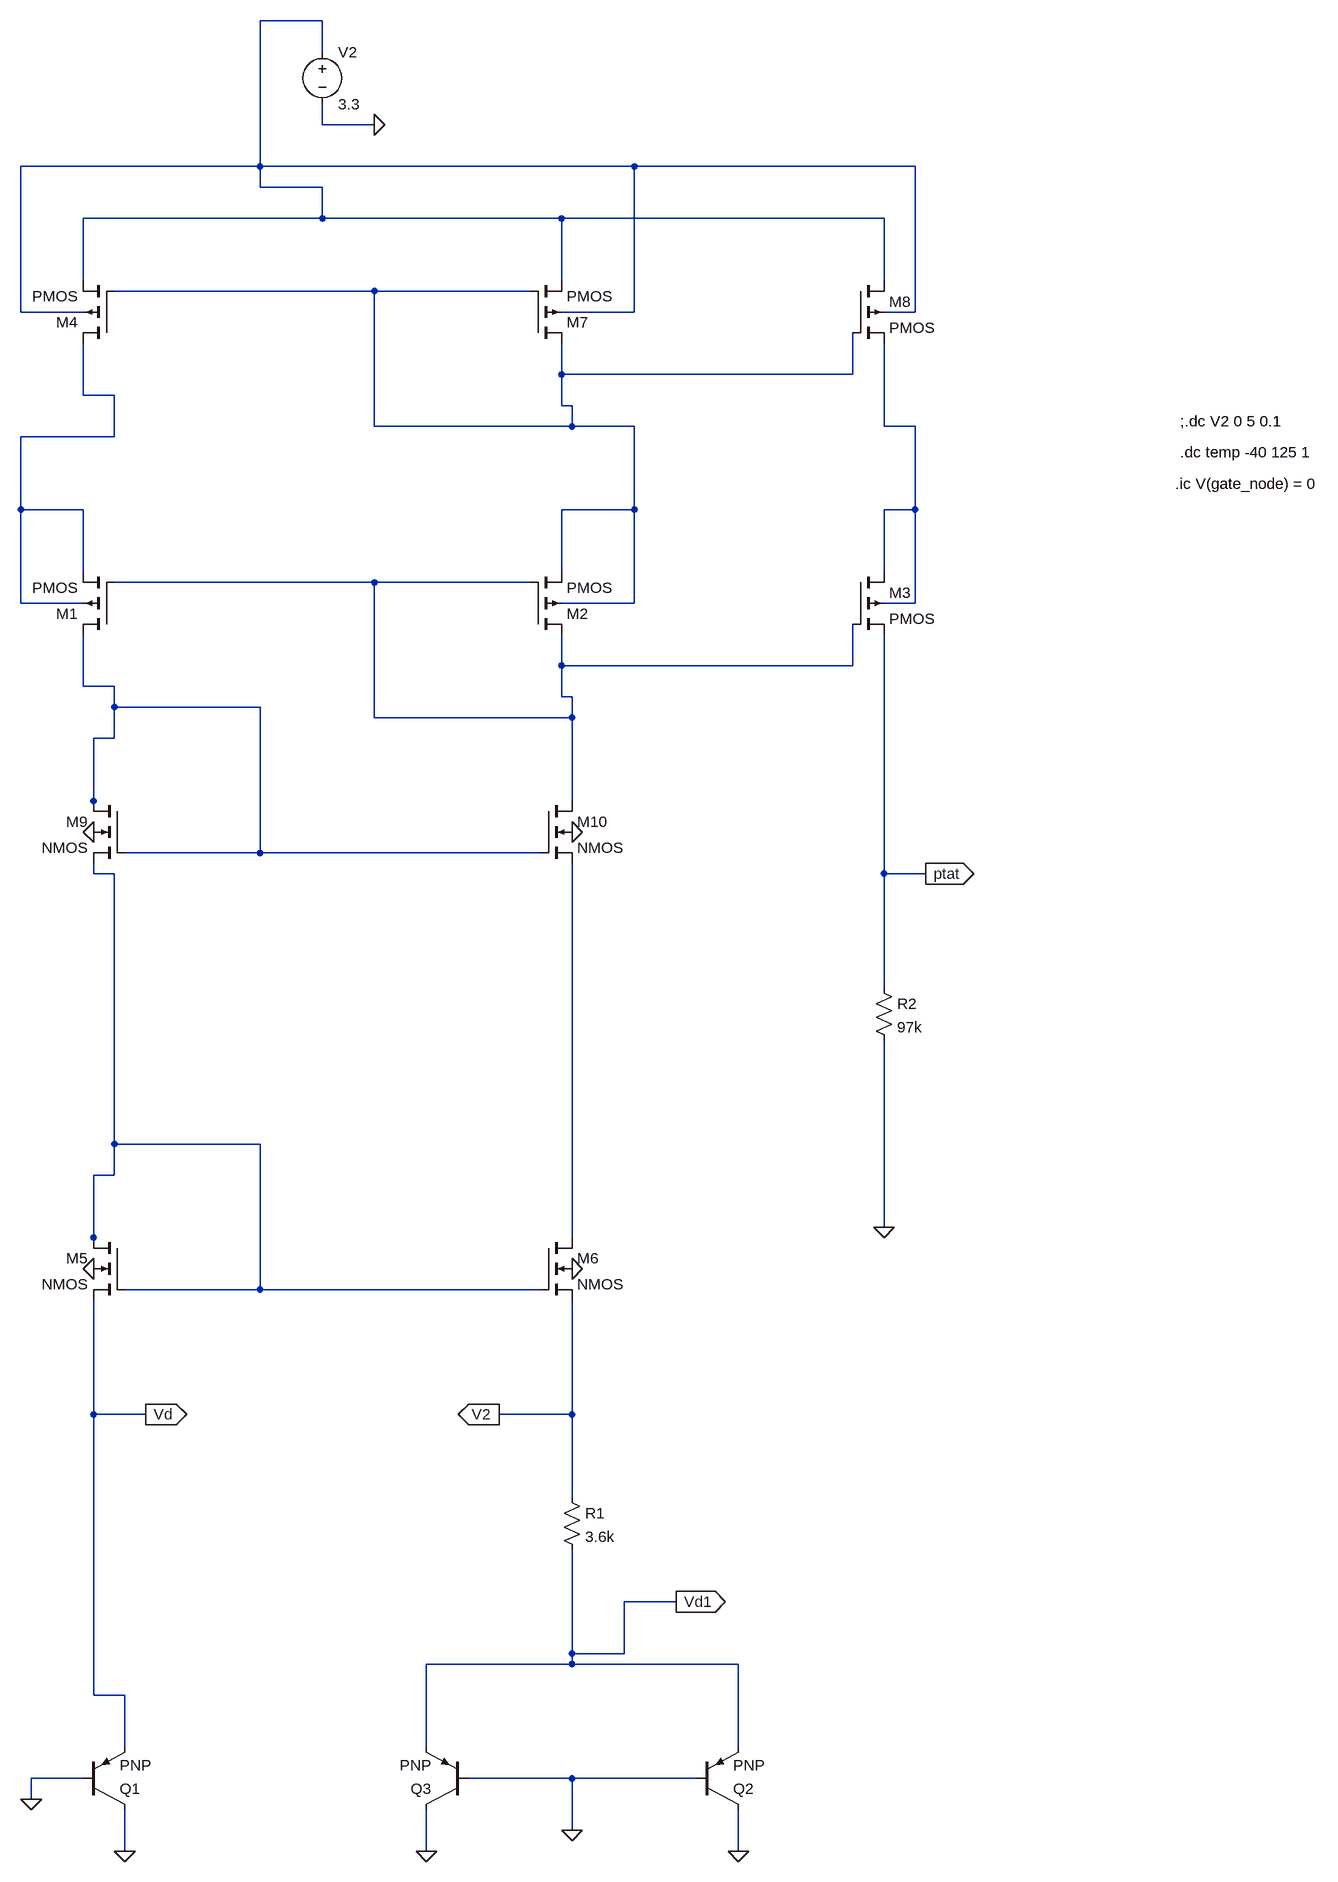
[diagram p0: schematic ptat.asc]
ptat.asc, the LTspice schematic file:
Version 4.1
SHEET 1 2292 692
WIRE 416 -2144 320 -2144
WIRE 416 -2096 416 -2144
WIRE 416 -1984 416 -2016
WIRE 496 -1984 416 -1984
WIRE 320 -1920 320 -2144
WIRE 320 -1920 -48 -1920
WIRE 896 -1920 320 -1920
WIRE 1328 -1920 896 -1920
WIRE 320 -1888 320 -1920
WIRE 416 -1888 320 -1888
WIRE 416 -1840 416 -1888
WIRE 416 -1840 48 -1840
WIRE 784 -1840 416 -1840
WIRE 1280 -1840 784 -1840
WIRE 48 -1744 48 -1840
WIRE 784 -1744 784 -1840
WIRE 1280 -1744 1280 -1840
WIRE 496 -1728 96 -1728
WIRE 736 -1728 496 -1728
WIRE -48 -1696 -48 -1920
WIRE 48 -1696 -48 -1696
WIRE 896 -1696 896 -1920
WIRE 896 -1696 784 -1696
WIRE 1328 -1696 1328 -1920
WIRE 1328 -1696 1280 -1696
WIRE 784 -1600 784 -1648
WIRE 1232 -1600 1232 -1664
WIRE 1232 -1600 784 -1600
WIRE 48 -1568 48 -1648
WIRE 96 -1568 48 -1568
WIRE 784 -1552 784 -1600
WIRE 800 -1552 784 -1552
WIRE 496 -1520 496 -1728
WIRE 800 -1520 800 -1552
WIRE 800 -1520 496 -1520
WIRE 896 -1520 800 -1520
WIRE 1280 -1520 1280 -1648
WIRE 1328 -1520 1280 -1520
WIRE 96 -1504 96 -1568
WIRE 96 -1504 -48 -1504
WIRE -48 -1392 -48 -1504
WIRE 48 -1392 -48 -1392
WIRE 896 -1392 896 -1520
WIRE 896 -1392 784 -1392
WIRE 1328 -1392 1328 -1520
WIRE 1328 -1392 1280 -1392
WIRE 48 -1296 48 -1392
WIRE 784 -1296 784 -1392
WIRE 1280 -1296 1280 -1392
WIRE 496 -1280 96 -1280
WIRE 736 -1280 496 -1280
WIRE -48 -1248 -48 -1392
WIRE 48 -1248 -48 -1248
WIRE 896 -1248 896 -1392
WIRE 896 -1248 784 -1248
WIRE 1328 -1248 1328 -1392
WIRE 1328 -1248 1280 -1248
WIRE 784 -1152 784 -1200
WIRE 1232 -1152 1232 -1216
WIRE 1232 -1152 784 -1152
WIRE 48 -1120 48 -1200
WIRE 96 -1120 48 -1120
WIRE 784 -1104 784 -1152
WIRE 800 -1104 784 -1104
WIRE 96 -1088 96 -1120
WIRE 320 -1088 96 -1088
WIRE 496 -1072 496 -1280
WIRE 800 -1072 800 -1104
WIRE 800 -1072 496 -1072
WIRE 96 -1040 96 -1088
WIRE 96 -1040 64 -1040
WIRE 64 -944 64 -1040
WIRE 800 -944 800 -1072
WIRE 64 -928 64 -944
WIRE 320 -864 320 -1088
WIRE 320 -864 112 -864
WIRE 752 -864 320 -864
WIRE 64 -832 64 -848
WIRE 96 -832 64 -832
WIRE 1280 -832 1280 -1200
WIRE 1344 -832 1280 -832
WIRE 1280 -656 1280 -832
WIRE 96 -416 96 -832
WIRE 320 -416 96 -416
WIRE 96 -368 96 -416
WIRE 96 -368 64 -368
WIRE 1280 -288 1280 -576
WIRE 64 -272 64 -368
WIRE 800 -272 800 -848
WIRE 64 -256 64 -272
WIRE 320 -192 320 -416
WIRE 320 -192 112 -192
WIRE 752 -192 320 -192
WIRE 64 0 64 -176
WIRE 144 0 64 0
WIRE 800 0 800 -176
WIRE 800 0 688 0
WIRE 800 128 800 0
WIRE 960 288 880 288
WIRE 800 368 800 208
WIRE 880 368 880 288
WIRE 880 368 800 368
WIRE 800 384 800 368
WIRE 800 384 576 384
WIRE 1056 384 800 384
WIRE 64 432 64 0
WIRE 112 432 64 432
WIRE 112 512 112 432
WIRE 576 512 576 384
WIRE 1056 512 1056 384
WIRE 48 560 -32 560
WIRE 800 560 640 560
WIRE 992 560 800 560
WIRE -32 592 -32 560
WIRE 800 640 800 560
WIRE 112 672 112 608
WIRE 576 672 576 608
WIRE 1056 672 1056 608
FLAG 112 672 0
FLAG -32 592 0
FLAG 800 640 0
FLAG 576 672 0
FLAG 1056 672 0
FLAG 960 288 Vd1
IOPIN 960 288 Out
FLAG 144 0 Vd
IOPIN 144 0 Out
FLAG 688 0 V2
IOPIN 688 0 Out
FLAG 64 -224 0
FLAG 800 -224 0
FLAG 1280 -288 0
FLAG 496 -1984 0
FLAG 64 -896 0
FLAG 800 -896 0
FLAG 1344 -832 ptat
IOPIN 1344 -832 Out
SYMBOL pnp 48 608 M180
SYMATTR InstName Q1
SYMBOL pnp 992 608 M180
SYMATTR InstName Q2
SYMBOL pnp 640 608 R180
SYMATTR InstName Q3
SYMBOL res 784 112 R0
SYMATTR InstName R1
SYMATTR Value 3.6k
SYMBOL nmos4 112 -272 M0
SYMATTR InstName M5
SYMATTR Value2 l=50u w=100u
SYMBOL nmos4 752 -272 R0
SYMATTR InstName M6
SYMATTR Value2 l=50u w=100u
SYMBOL pmos4 96 -1200 R180
SYMATTR InstName M1
SYMATTR Value2 l=50u w=100u
SYMBOL pmos4 736 -1200 M180
SYMATTR InstName M2
SYMATTR Value2 l=50u w=100u
SYMBOL pmos4 1232 -1296 R0
SYMATTR InstName M3
SYMATTR Value2 l=50u w=100u
SYMBOL res 1264 -672 R0
SYMATTR InstName R2
SYMATTR Value 97k
SYMBOL voltage 416 -2112 R0
WINDOW 123 0 0 Left 0
WINDOW 39 0 0 Left 0
SYMATTR InstName V2
SYMATTR Value 3.3
SYMBOL pmos4 96 -1648 R180
SYMATTR InstName M4
SYMATTR Value2 l=50u w=100u
SYMBOL pmos4 736 -1648 M180
SYMATTR InstName M7
SYMATTR Value2 l=50u w=100u
SYMBOL pmos4 1232 -1744 R0
SYMATTR InstName M8
SYMATTR Value2 l=50u w=100u
SYMBOL nmos4 112 -944 M0
SYMATTR InstName M9
SYMATTR Value2 l=50u w=100u
SYMBOL nmos4 752 -944 R0
SYMATTR InstName M10
SYMATTR Value2 l=50u w=100u
TEXT 1728 -1432 Left 2 !.ic V(gate_node) = 0
TEXT 1736 -1480 Left 2 !.dc temp -40 125 1
TEXT 1736 -1528 Left 2 !;.dc V2 0 5 0.1

The netlist it stands for:
* ptat.asc
Q1 0 0 Vd 0 PNP
Q2 0 0 Vd1 0 PNP
Q3 0 0 Vd1 0 PNP
R1 V2 Vd1 3.6k
M5 N007 N007 Vd 0 NMOS l=50u w=100u
M6 N008 N007 V2 0 NMOS l=50u w=100u
M1 N006 N005 N003 N003 PMOS l=50u w=100u
M2 N005 N005 N002 N002 PMOS l=50u w=100u
M3 N004 N005 ptat N004 PMOS l=50u w=100u
R2 ptat 0 97k
V2 N001 0 3.3
M4 N003 N002 N001 N001 PMOS l=50u w=100u
M7 N002 N002 N001 N001 PMOS l=50u w=100u
M8 N001 N002 N004 N001 PMOS l=50u w=100u
M9 N006 N006 N007 0 NMOS l=50u w=100u
M10 N005 N006 N008 0 NMOS l=50u w=100u
.model NPN NPN
.model PNP PNP
.lib standard.bjt
.model NMOS NMOS
.model PMOS PMOS
.lib standard.mos
.ic V(gate_node) = 0
.dc temp -40 125 1
;.dc V2 0 5 0.1
.backanno
.end